# Altium schematic sheet 12 MSM8916_POWER3.SchDoc
size 871 x 579 mm
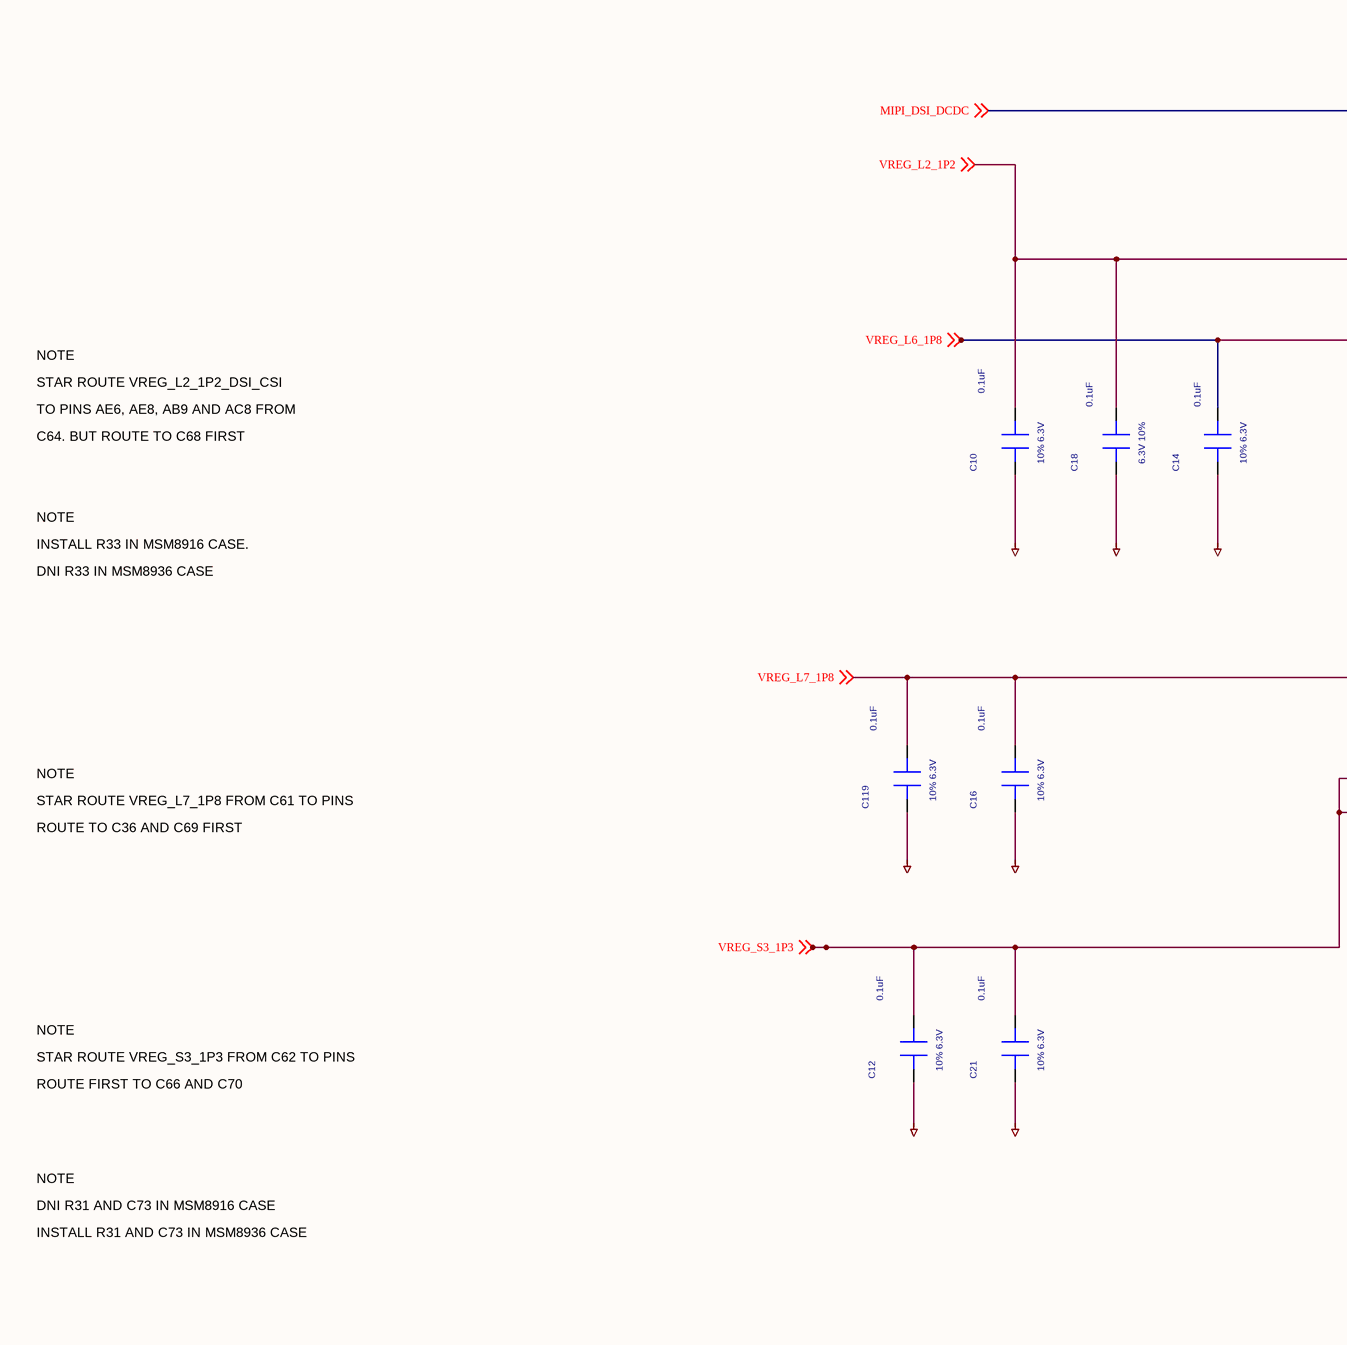
[diagram p0: 12 MSM8916_POWER3.SchDoc, top left]
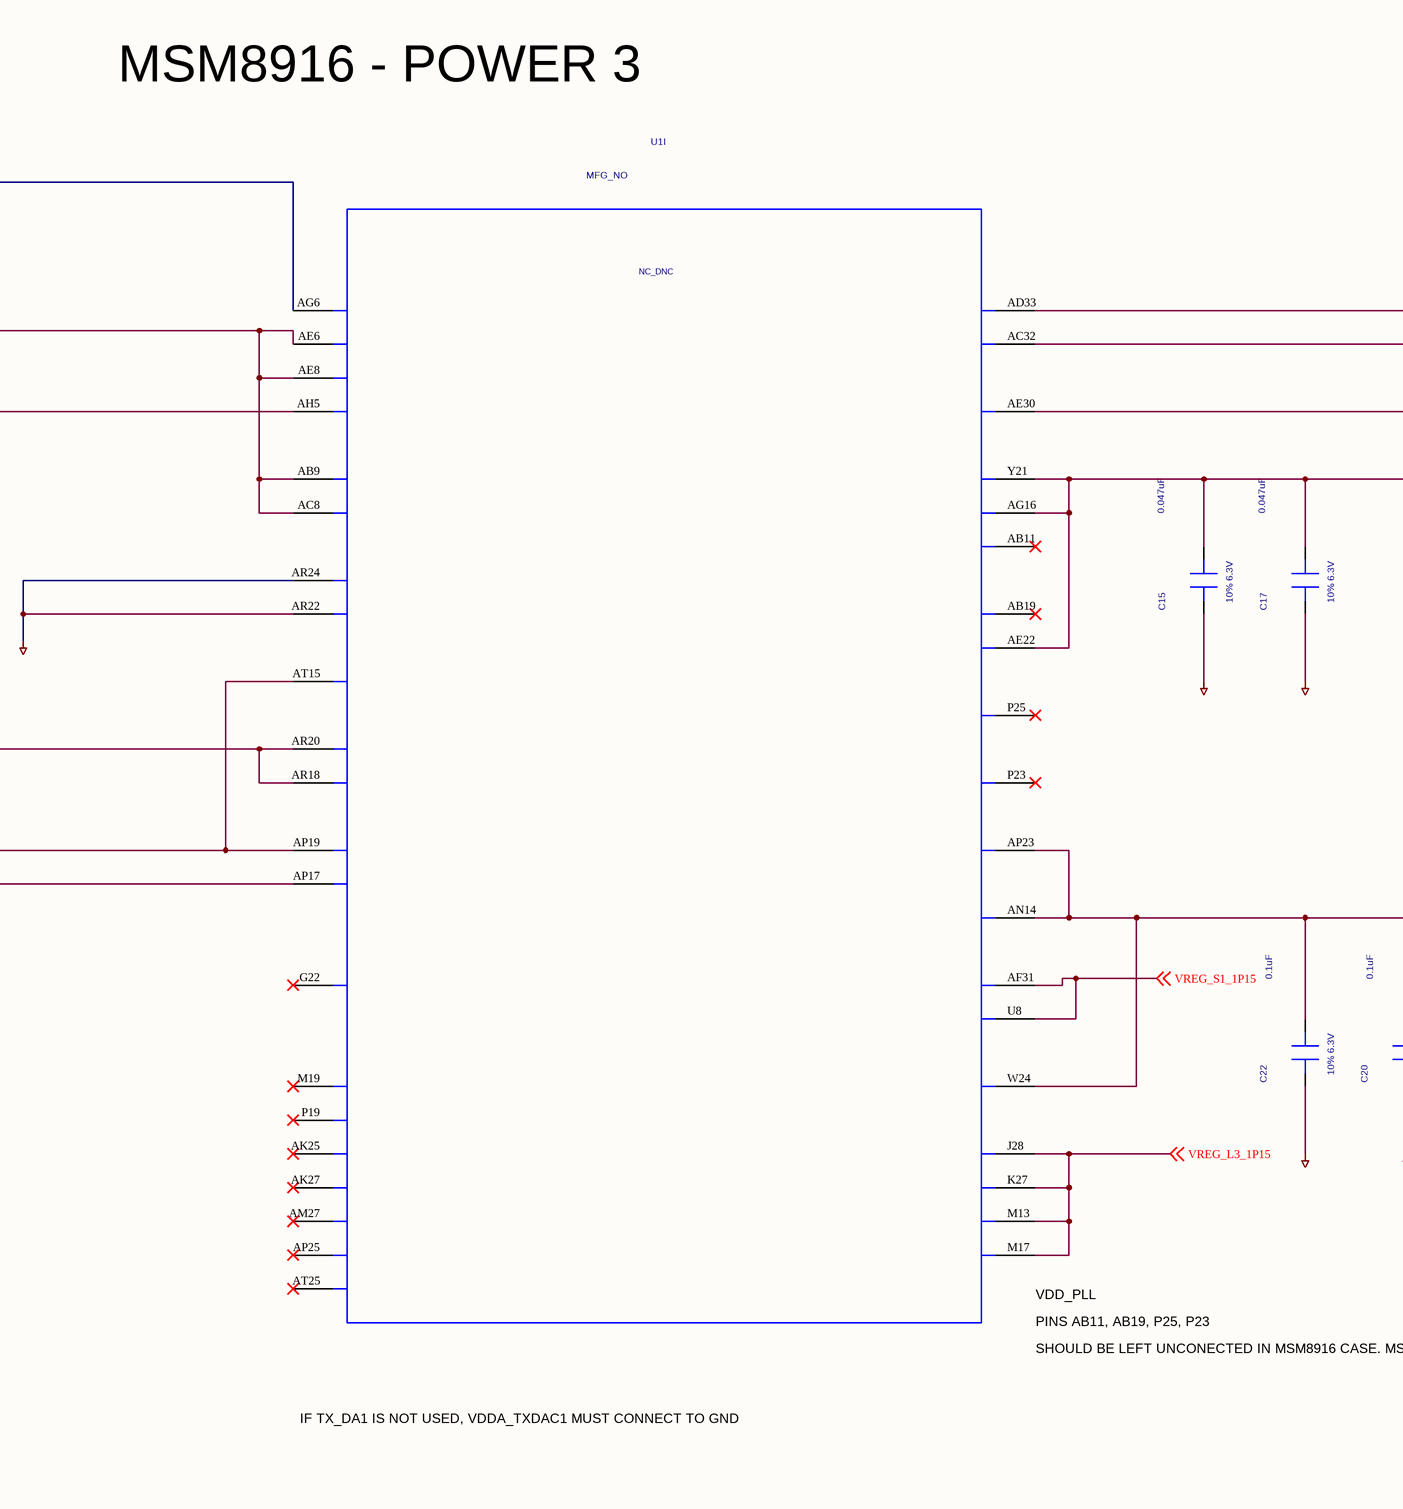
[diagram p1: 12 MSM8916_POWER3.SchDoc, top middle]
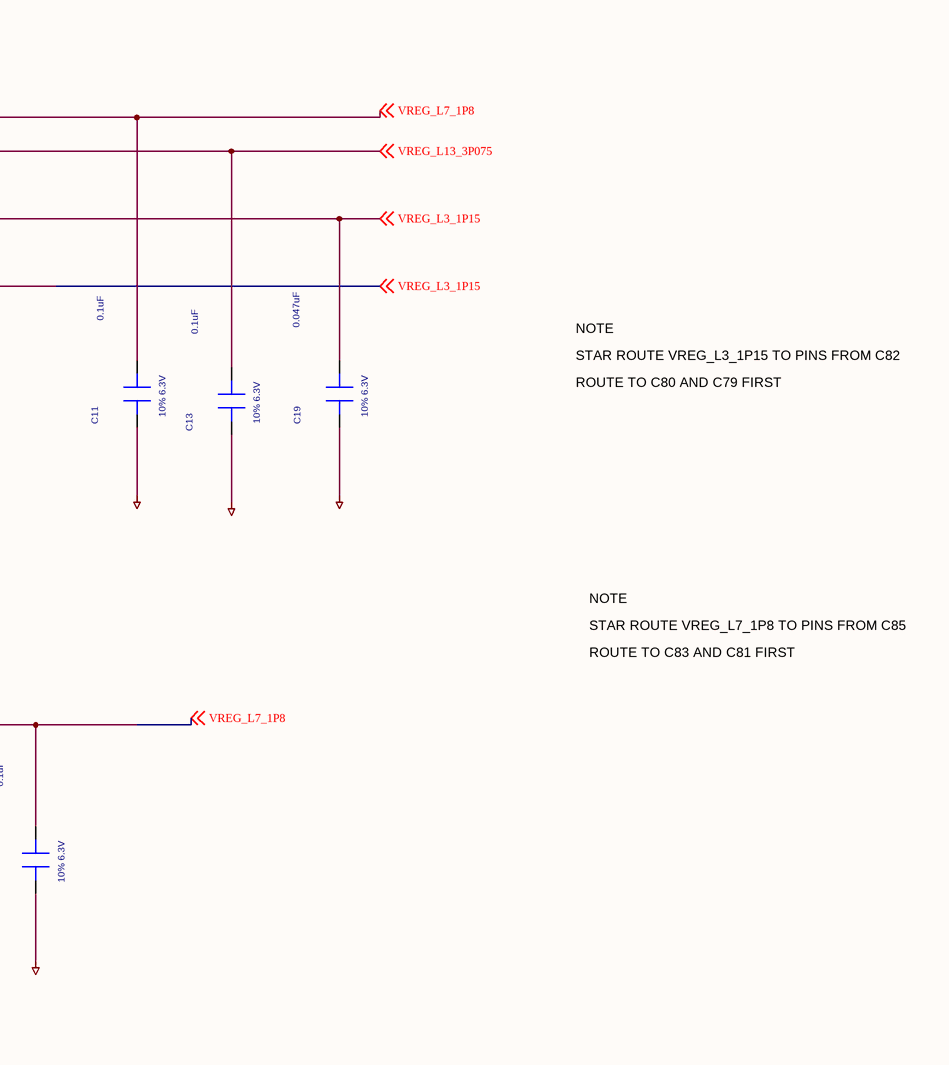
[diagram p2: 12 MSM8916_POWER3.SchDoc, top right]
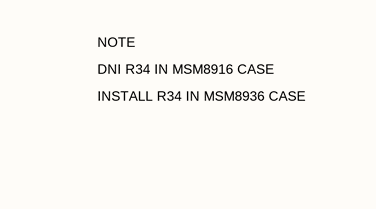
[diagram p3: 12 MSM8916_POWER3.SchDoc, bottom middle]
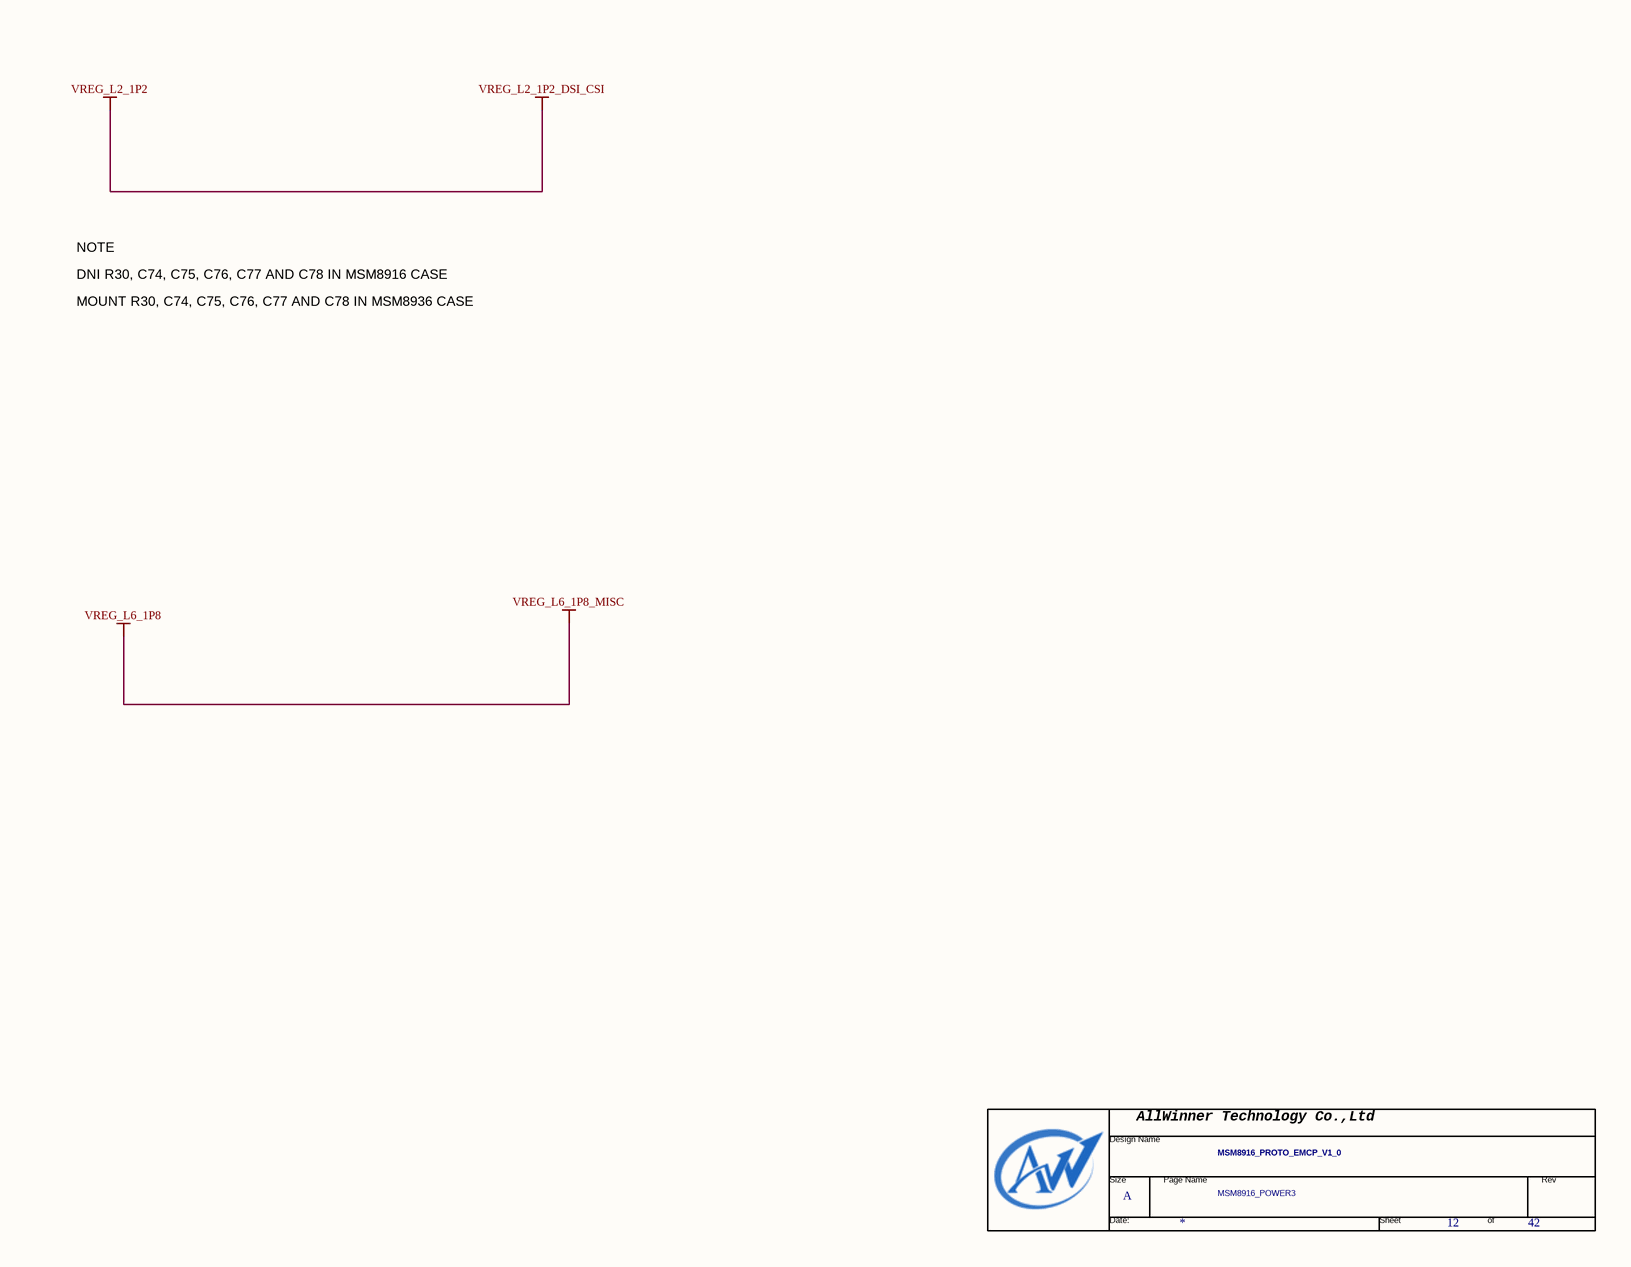
[diagram p4: 12 MSM8916_POWER3.SchDoc, bottom right]

## Parts
*  Page Count: 42  Page Number: 12  Page Size: A  Title: MSM8916_PROTO_EMCP_V1_0  Doc: MSM8916_POWER3  (hidden comment: TitleBlock0-AW)  (graphical)
C10  0.1uF  Tolerance: 10% 6.3V  [c0402]
C11  0.1uF  Tolerance: 10% 6.3V  [c0402]
C12  0.1uF  Tolerance: 10% 6.3V  [c0402]
C13  0.1uF  Tolerance: 10% 6.3V  [c0402]
C14  0.1uF  Tolerance: 10% 6.3V  [c0402]
C15  0.047uF  Tolerance: 10% 6.3V  [c0402]
C16  0.1uF  Tolerance: 10% 6.3V  [c0402]
C17  0.047uF  Tolerance: 10% 6.3V  [c0402]
C18  0.1uF  Tolerance: 6.3V 10%  [c0402]
C19  0.047uF  Tolerance: 10% 6.3V  [c0402]
C20  0.1uF  Tolerance: 10% 6.3V  [c0402]
C21  0.1uF  Tolerance: 10% 6.3V  [c0402]
C22  0.1uF  Tolerance: 10% 6.3V  [c0402]
C119  0.1uF  Tolerance: 10% 6.3V  [c0402]
U1  SYMNAME: NC_DNC  PART_ID: MFG_NO  [MSM-8916-0-760NSP-TR-00-0]  (hidden comment: ASIC_MSM8936_760PIN)  (part I of 13)

## Nets
DGND: C10.1(POS) C11.1(POS) C12.1(POS) C13.1(POS) C14.1(POS) C15.1(POS) C16.1(POS) C17.1(POS) C18.1(POS) C19.1(POS) C20.1(POS) C21.1(POS) C22.1(POS) C119.1(POS) U1.AR22(VDDA_TXDAC1) U1.AR24(VDDA_TXDAC0)
VREG_L2_1P2: C10.2(NEG) C18.2(NEG) U1.AB9(VDDA_MIPI_CSI_1) U1.AC8(VDDA_MIPI_CSI_2) U1.AE6(VDDA_1P2_MIPI_DSI_1) U1.AE8(VDDA_1P2_MIPI_DSI_2) ; off-sheet VREG_L2_1P2  [also labelled VREG_L2_1P2_DSI_CSI]
VREG_L6_1P8: C14.2(NEG) U1.AH5(VDDA_MIPI_DSI_PLL) ; off-sheet VREG_L6_1P8  [also labelled VREG_L6_1P8_MISC]
MIPI_DSI_DCDC: U1.AG6(VDDA_0P4_MIPI_DSI) ; off-sheet MIPI_DSI_DCDC
VREG_L3_1P15: C15.2(NEG) C17.2(NEG) C19.2(NEG) U1.AE22(VDD_SR_MPLL2_GPLL1) U1.AE30(USB2_HS_DVDD) U1.AG16(VDD_SR_GPLL3) U1.J28(VDDA_CDC_EBI0_CA_D0_D1_D2_D3_1) U1.K27(VDDA_CDC_EBI0_CA_D0_D1_D2_D3_2) U1.M13(VDDA_CDC_EBI0_CA_D0_D1_D2_D3_3) U1.M17(VDDA_CDC_EBI0_CA_D0_D1_D2_D3_4) U1.Y21(VDD_SR_GPLL0_GPLL2) ; off-sheet VREG_L3_1P15
VREG_L7_1P8: C11.2(NEG) C16.2(NEG) C20.2(NEG) C22.2(NEG) C119.2(NEG) U1.AD33(USB2_HS_VDDA_1P8) U1.AN14(VDD_SR2_PRONTO_PLL) U1.AP23(VDD_SR2_MODEM_PLL1) U1.AR18(VDDAH_BBRX_CH2) U1.AR20(VDDAH_BBRX_CH0_1) U1.W24(VDD_HF_APPS_PLL) ; off-sheet VREG_L7_1P8
VREG_L13_3P075: C13.2(NEG) U1.AC32(USB2_HS_VDDA_3P3) ; off-sheet VREG_L13_3P075
VREG_S1_1P15: U1.AF31(VDD_CDC_SDC1) U1.U8(VDD_CDC_SDC2) ; off-sheet VREG_S1_1P15
VREG_S3_1P3: C12.2(NEG) C21.2(NEG) U1.AP17(VDDAL_BBRX_CH2_GPSADC) U1.AP19(VDDAL_BBRX_CH0_1) U1.AT15(VDDA_WLAN) ; off-sheet VREG_S3_1P3

Not connected (* = marked no-connect by the designer): U1 AB11(VDD_SR_GPLL4)* AB19(VDD_SR_MPLL0_GPLL6)* AK25(VDD_MSS_3)* AK27(VDD_MSS_4)* AM27(VDD_MSS_5)* AP25(VDD_MSS_6)* AT25(VDD_MSS_7)* G22(VDDA_PLL_1P8)* M19(VDD_MSS_1)* P19(VDD_MSS_2)* P23(VDD_SR2_BIMC_GPLL5)* P25(VDD_SR2_APPS_PLL)*

## Notes on the sheet
- MSM8916 - POWER 3
- TO PINS AE6, AE8, AB9 AND AC8 FROM
- STAR ROUTE VREG_L2_1P2_DSI_CSI
- NOTE
- C64. BUT ROUTE TO C68 FIRST
- STAR ROUTE VREG_L3_1P15 TO PINS FROM C82
- INSTALL R33 IN MSM8916 CASE.
- ROUTE TO C80 AND C79 FIRST
- DNI R33 IN MSM8936 CASE
- STAR ROUTE VREG_L7_1P8 TO PINS FROM C85
- STAR ROUTE VREG_L7_1P8 FROM C61 TO PINS
- ROUTE TO C83 AND C81 FIRST
- ROUTE TO C36 AND C69 FIRST
- STAR ROUTE VREG_S3_1P3 FROM C62 TO PINS
- ROUTE FIRST TO C66 AND C70
- DNI R31 AND C73 IN MSM8916 CASE
- (near U1) VDD_PLL
- INSTALL R31 AND C73 IN MSM8936 CASE
- SHOULD BE LEFT UNCONECTED IN MSM8916 CASE. MSM PACKAGE HAS THEM UNBOUNDED INTERNALLY
- (near U1) PINS AB11, AB19, P25, P23
- IF TX_DA1 IS NOT USED, VDDA_TXDAC1 MUST CONNECT TO GND
- DNI R34 IN MSM8916 CASE
- INSTALL R34 IN MSM8936 CASE
- MOUNT R30, C74, C75, C76, C77 AND C78 IN MSM8936 CASE
- DNI R30, C74, C75, C76, C77 AND C78 IN MSM8916 CASE
- (in symbol TitleBlock0-AW) AllWinner Technology Co.,Ltd; Design Name; Size; Page Name; Rev; Date:; Sheet; of

## Library data of the parts
C10-C22 C119 = CAP#1: PART_NUMBER: MCN_NO; PART_ID: MFG_NO; OriginalSymbolOrigin: (-75,50); VOLT: ?V; SYMNAME: CAP; CDS_LMAN_SYM_OUTLINE: -25,50,25,-50; PACK_TYPE: ?
U1 = ASIC_MSM8936_760PIN: PART_NUMBER: MCN_NO; OriginalSymbolOrigin: (-1100,2500); SPLIT_INST: TRUE; CDS_LMAN_SYM_OUTLINE: -1050,2500,1050,-2500; CDS_LMAN_SPLIT_NUMBER: 1 of 13; PACK_TYPE: ?
* = TitleBlock0-AW: RevCode: ?; Page Create Date: March  8, 1995; Page Modify Date: *